# Altium schematic sheet TopLevelDesign.SchDoc
size B; SheetNumber: 2; SheetTotal: 15
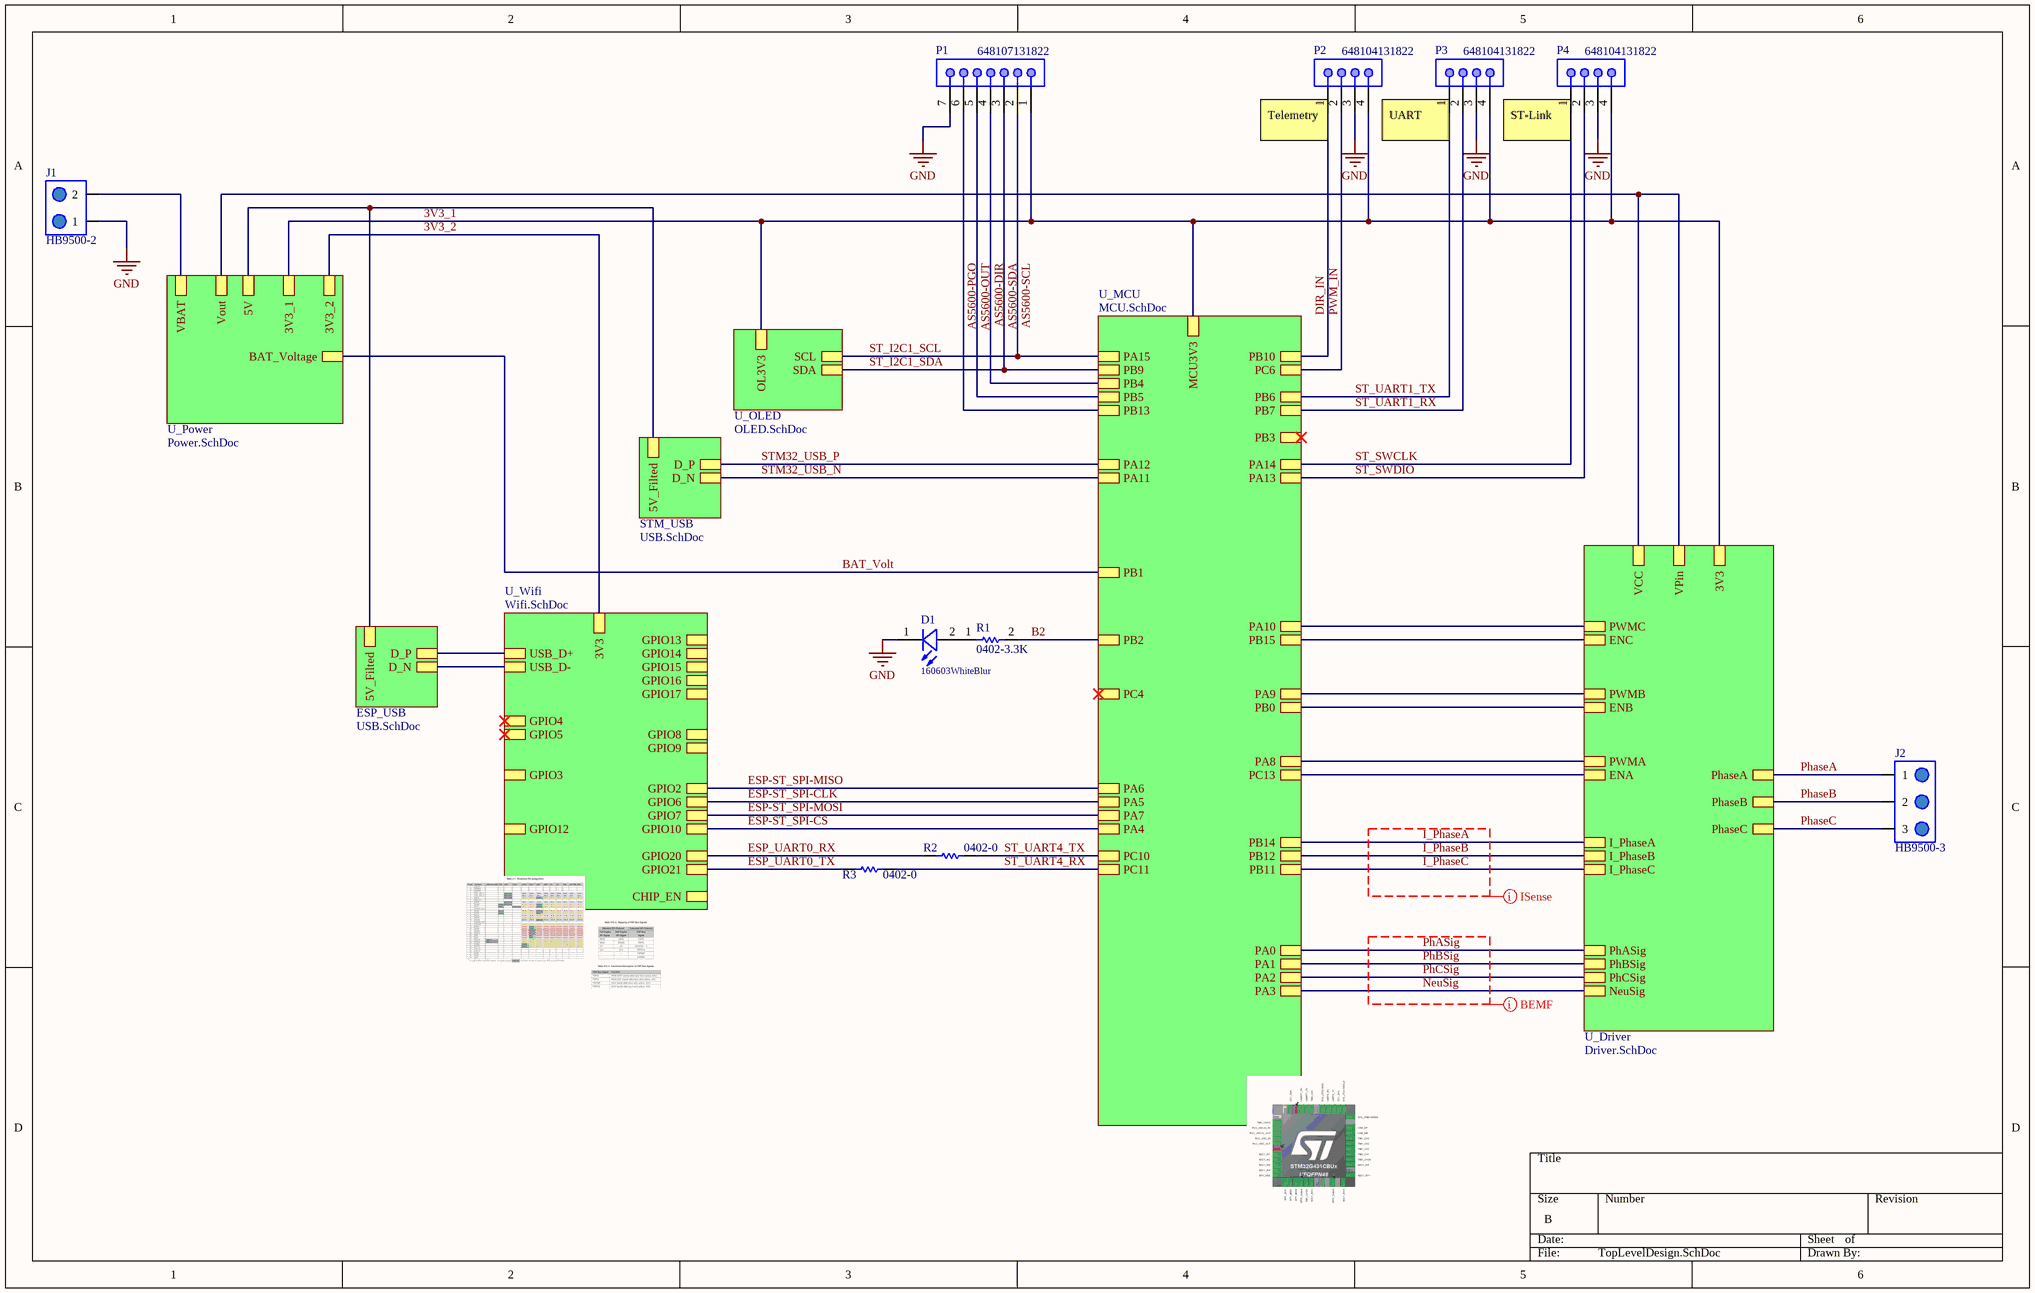
[diagram p0: TopLevelDesign.SchDoc]

## Parts
D1  160603WhiteBlur  [WL-SMCW_0603_H=0.7mm]
J1  HB9500-2  [HB9500-2]
J2  HB9500-3  [HB9500-3]
P1  648107131822  [648107131822]
P2  648104131822  [648104131822]
P3  648104131822  [648104131822]
P4  648104131822  [648104131822]
R1  0402-3.3K  [R-0402-10K]
R2  0402-0  [R-0402-1K]
R3  0402-0  [R-0402-1K]

## Sub-sheets
ESP_USB = USB.SchDoc: D_N, D_P, 5V_Filted
STM_USB = USB.SchDoc: D_N, D_P, 5V_Filted
U_Driver = Driver.SchDoc: VCC, VPin, 3V3, PhaseC, PhaseB, PhaseA, PWMC, ENC, PWMB, ENB, PWMA, ENA, I_PhaseC, I_PhaseB, I_PhaseA, PhASig, PhBSig, PhCSig, NeuSig
U_MCU = MCU.SchDoc: PB0, PB1, PB2, PB3, PB4, PB5, PB6, PB7, PB9, PB10, PB11, PB12, PB13, PB14, PB15, PC4, PC6, PC10, PC11, PC13, PA0, PA1, PA2, PA3, PA4, PA5, PA6, PA7, PA8, PA9, PA10, PA11, PA12, PA13, PA14, PA15, MCU3V3
U_OLED = OLED.SchDoc: OL3V3, SCL, SDA
U_Power = Power.SchDoc: VBAT, BAT_Voltage, 5V, 3V3_1, Vout, 3V3_2
U_Wifi = Wifi.SchDoc: 3V3, USB_D-, USB_D+, GPIO8, GPIO9, GPIO10, GPIO4, GPIO5, GPIO6, GPIO7, GPIO2, GPIO3, CHIP_EN, GPIO20, GPIO21, GPIO12, GPIO13, GPIO14, GPIO15, GPIO16, GPIO17

## Nets
GND: D1.1(K) J1.1 P1.7 P2.3 P3.3 P4.3
3V3_1: P1.1 P2.4 P3.4 P4.4 ; sheet U_MCU/MCU3V3, sheet U_OLED/OL3V3, sheet U_Power/3V3_1, sheet U_Driver/3V3
3V3_2: sheet U_Wifi/3V3, sheet U_Power/3V3_2
AS5600-DIR: P1.4 ; sheet U_MCU/PB4
AS5600-OUT: P1.5 ; sheet U_MCU/PB5
AS5600-PGO: P1.6 ; sheet U_MCU/PB13
AS5600-SCL: P1.2 ; sheet U_MCU/PA15, sheet U_OLED/SCL  [also labelled ST_I2C1_SCL]
AS5600-SDA: P1.3 ; sheet U_MCU/PB9, sheet U_OLED/SDA  [also labelled ST_I2C1_SDA]
B2: R1.2 ; sheet U_MCU/PB2
BAT_Volt: sheet U_MCU/PB1, sheet U_Power/BAT_Voltage
DIR_IN: P2.1 ; sheet U_MCU/PB10
ESP-ST_SPI-CLK: sheet U_MCU/PA5, sheet U_Wifi/GPIO6
ESP-ST_SPI-CS: sheet U_MCU/PA4, sheet U_Wifi/GPIO10
ESP-ST_SPI-MISO: sheet U_MCU/PA6, sheet U_Wifi/GPIO2
ESP-ST_SPI-MOSI: sheet U_MCU/PA7, sheet U_Wifi/GPIO7
ESP_UART0_RX: R2.1 ; sheet U_Wifi/GPIO20
ESP_UART0_TX: R3.1 ; sheet U_Wifi/GPIO21
I_PhaseA: sheet U_MCU/PB14, sheet U_Driver/I_PhaseA
I_PhaseB: sheet U_MCU/PB12, sheet U_Driver/I_PhaseB
I_PhaseC: sheet U_MCU/PB11, sheet U_Driver/I_PhaseC
NeuSig: sheet U_MCU/PA3, sheet U_Driver/NeuSig
PhaseA: J2.1 ; sheet U_Driver/PhaseA
PhaseB: J2.2 ; sheet U_Driver/PhaseB
PhaseC: J2.3 ; sheet U_Driver/PhaseC
PhASig: sheet U_MCU/PA0, sheet U_Driver/PhASig
PhBSig: sheet U_MCU/PA1, sheet U_Driver/PhBSig
PhCSig: sheet U_MCU/PA2, sheet U_Driver/PhCSig
PWM_IN: P2.2 ; sheet U_MCU/PC6
ST_SWCLK: P4.1 ; sheet U_MCU/PA14
ST_SWDIO: P4.2 ; sheet U_MCU/PA13
ST_UART1_RX: P3.2 ; sheet U_MCU/PB7
ST_UART1_TX: P3.1 ; sheet U_MCU/PB6
ST_UART4_RX: R3.2 ; sheet U_MCU/PC11
ST_UART4_TX: R2.2 ; sheet U_MCU/PC10
STM32_USB_N: sheet STM_USB/D_N, sheet U_MCU/PA11
STM32_USB_P: sheet STM_USB/D_P, sheet U_MCU/PA12
NetD1_2: D1.2(A) R1.1
NetJ1_2: J1.2 ; sheet U_Power/VBAT
(unnamed): sheet ESP_USB/D_N, sheet U_Wifi/USB_D-
(unnamed): sheet ESP_USB/D_P, sheet U_Wifi/USB_D+
(unnamed): sheet ESP_USB/5V_Filted, sheet STM_USB/5V_Filted, sheet U_Power/5V
(unnamed): sheet U_MCU/PB0, sheet U_Driver/ENB
(unnamed): sheet U_MCU/PB15, sheet U_Driver/ENC
(unnamed): sheet U_MCU/PC13, sheet U_Driver/ENA
(unnamed): sheet U_MCU/PA8, sheet U_Driver/PWMA
(unnamed): sheet U_MCU/PA9, sheet U_Driver/PWMB
(unnamed): sheet U_MCU/PA10, sheet U_Driver/PWMC
(unnamed): sheet U_Power/Vout, sheet U_Driver/VCC, sheet U_Driver/VPin

## Layout directives
net class BEMF: NeuSig, PhASig, PhBSig, PhCSig
net class ISense: I_PhaseA, I_PhaseB, I_PhaseC

## Notes on the sheet
- (near P2) Telemetry
- UART
- ST-Link

## Library data of the parts
D1 = CMP-004-00095-1: WL-SMCW SMT Mono-color Chip LED Blur, size 0603, White; ComponentLink3Description: Supplier 2 URL; Design Item ID: 160603WhiteBlur; Component Type: Standard; Size: 0603; Supplier 1 SN: 755-SMLEN3WBC8W1; Color: White; Supplier 3 Name: ICDayRoi; Supplier 3 URL: N/A; Pins: 2; Supplier 2 URL: https://www.digikey.com/en/products/detail/qt-brightek-qtb/QBLP601-IW/4814655; ComponentLink1URL: N/A; ComponentLink3URL: https://www.digikey.com/en/products/detail/qt-brightek-qtb/QBLP601-IW/4814655; Supplier 1 URL: https://www.mouser.vn/ProductDetail/ROHM-Semiconductor/SMLEN3WBC8W1?qs=W0yvOO0ixfGun78rr9Unsw%3D%3D; ComponentLink2URL: https://www.mouser.vn/ProductDetail/ROHM-Semiconductor/SMLEN3WBC8W1?qs=W0yvOO0ixfGun78rr9Unsw%3D%3D; ComponentLink4Description: Supplier 3 URL; Supplier 1 Name: Mouser; Supplier 3 SN: N/A; ComponentLink4URL: N/A; Source: WL-SMCW_0603.SchLib; Supplier 2 SN: 1516-1057-2-ND; Value: White; Supplier 2 Name: Digi-Key; ComponentLink2Description: Supplier 1 URL; ComponentLink1Description: Datasheet link; Type: Blur
J1 = CMP-118-000008-1: High Power Terminal , 25A , 300V; Pin Count: 2; Component Type: Standard; Design Item ID: HB9500-2; Source: HB9500-2.SchLib
J2 = CMP-118-000006-1: High Power Terminal , 25A , 300V; Design Item ID: HB9500-3; Component Type: Standard; Source: HB9500-3.SchLib; Pin Count: 3
P1 = CMP-002-01153-1: WR-WTB SMT Male Horizontal Shrouded Header, pitch 1.5mm, 7p; Working Voltage: 50VAC; Value: 1A, 50 V (AC); Rated Current: 1A; Contact Resistance: 20mOhm; Withstanding Voltage: 500VAC; Pin Number: 7; Operating Temperature: -25 to +85degC; ComponentLink3URL: https://www.we-online.com/en/components/products/WTB_1_50_SMT_MALE_HORIZONTAL_SHROUDED_HEADER_6481XX131822?sq=648107131822#648107131822; Supplier 2 URL: N/A; Supplier 1 URL: N/A; Supplier 1 Name: Mouser; Supplier 2 SN: N/A; Type: Horizontal; Source: WR-WTB_1.50mm.SchLib; Design Item ID: 648107131822; Supplier 3 SN: N/A; Pitch: 1.5mm; Part Number: 648107131822; Mounting Technology: SMT; ComponentLink1URL: http://www.we-online.de; Publisher: Wurth Elektronik; Packaging: Tape and Reel; ComponentLink3Description: Global Supply; ComponentLink2URL: https://www.we-online.com/catalog/datasheet/648107131822.pdf; Supplier 3 URL: N/A; Pins: 7; Supplier 1 SN: N/A; ComponentLink2Description: Datasheet; Supplier 2 Name: Digi-Key; Supplier 3 Name: thegioiic; ComponentLink1Description: Manufacturer; Component Type: Standard; Gender: Male; Published Date: January 2020
P2-P4 = CMP-002-01150-1: WR-WTB SMT Male Horizontal Shrouded Header, pitch 1.5mm, 4p; Working Voltage: 50VAC; Rated Current: 1A; Contact Resistance: 20mOhm; Pin Number: 4; Value: 1A, 50 V (AC); Withstanding Voltage: 500VAC; ComponentLink4URL: https://www.mouser.vn/ProductDetail/Wurth-Elektronik/648104131822?qs=ZtY9WdtwX57XPjIMVYKZ6w%3D%3D; ComponentLink3URL: https://www.we-online.com/en/components/products/WTB_1_50_SMT_MALE_HORIZONTAL_SHROUDED_HEADER_6481XX131822?sq=648104131822#648104131822; ComponentLink2Description: Datasheet; Supplier 3 URL: N/A; Mounting Technology: SMT; Operating Temperature: -25 to +85degC; Packaging: Tape and Reel; Pins: 4; Component Type: Standard; ComponentLink4Description: Global Supply; Supplier 1 URL: https://www.mouser.vn/ProductDetail/Wurth-Elektronik/648104131822?qs=ZtY9WdtwX57XPjIMVYKZ6w%3D%3D; Supplier 2 URL: N/A; Supplier 3 SN: N/A; Design Item ID: 648104131822; Supplier 1 Name: Mouser; Supplier 2 Name: Digi-Key; Supplier 2 SN: N/A; ComponentLink3Description: Global Supply; Part Number: 648104131822; Supplier 3 Name: thegioiic; Type: Horizontal; Gender: Male; Publisher: Wurth Elektronik; ComponentLink1Description: Manufacturer; Published Date: January 2020; Supplier 1 SN: 710-648104131822; ComponentLink1URL: http://www.we-online.de; Source: WR-WTB_1.50mm.SchLib; ComponentLink2URL: https://www.we-online.com/catalog/datasheet/648104131822.pdf; Pitch: 1.5mm
R1 = CMP-009-00688-1: RES 0402 3.3K; Value: 3.3k
R2 R3 = CMP-009-00678-4: 0402Resistor 0 Ohm; Value: 0